# Altium schematic sheet HDMI_OUT.SchDoc
size B
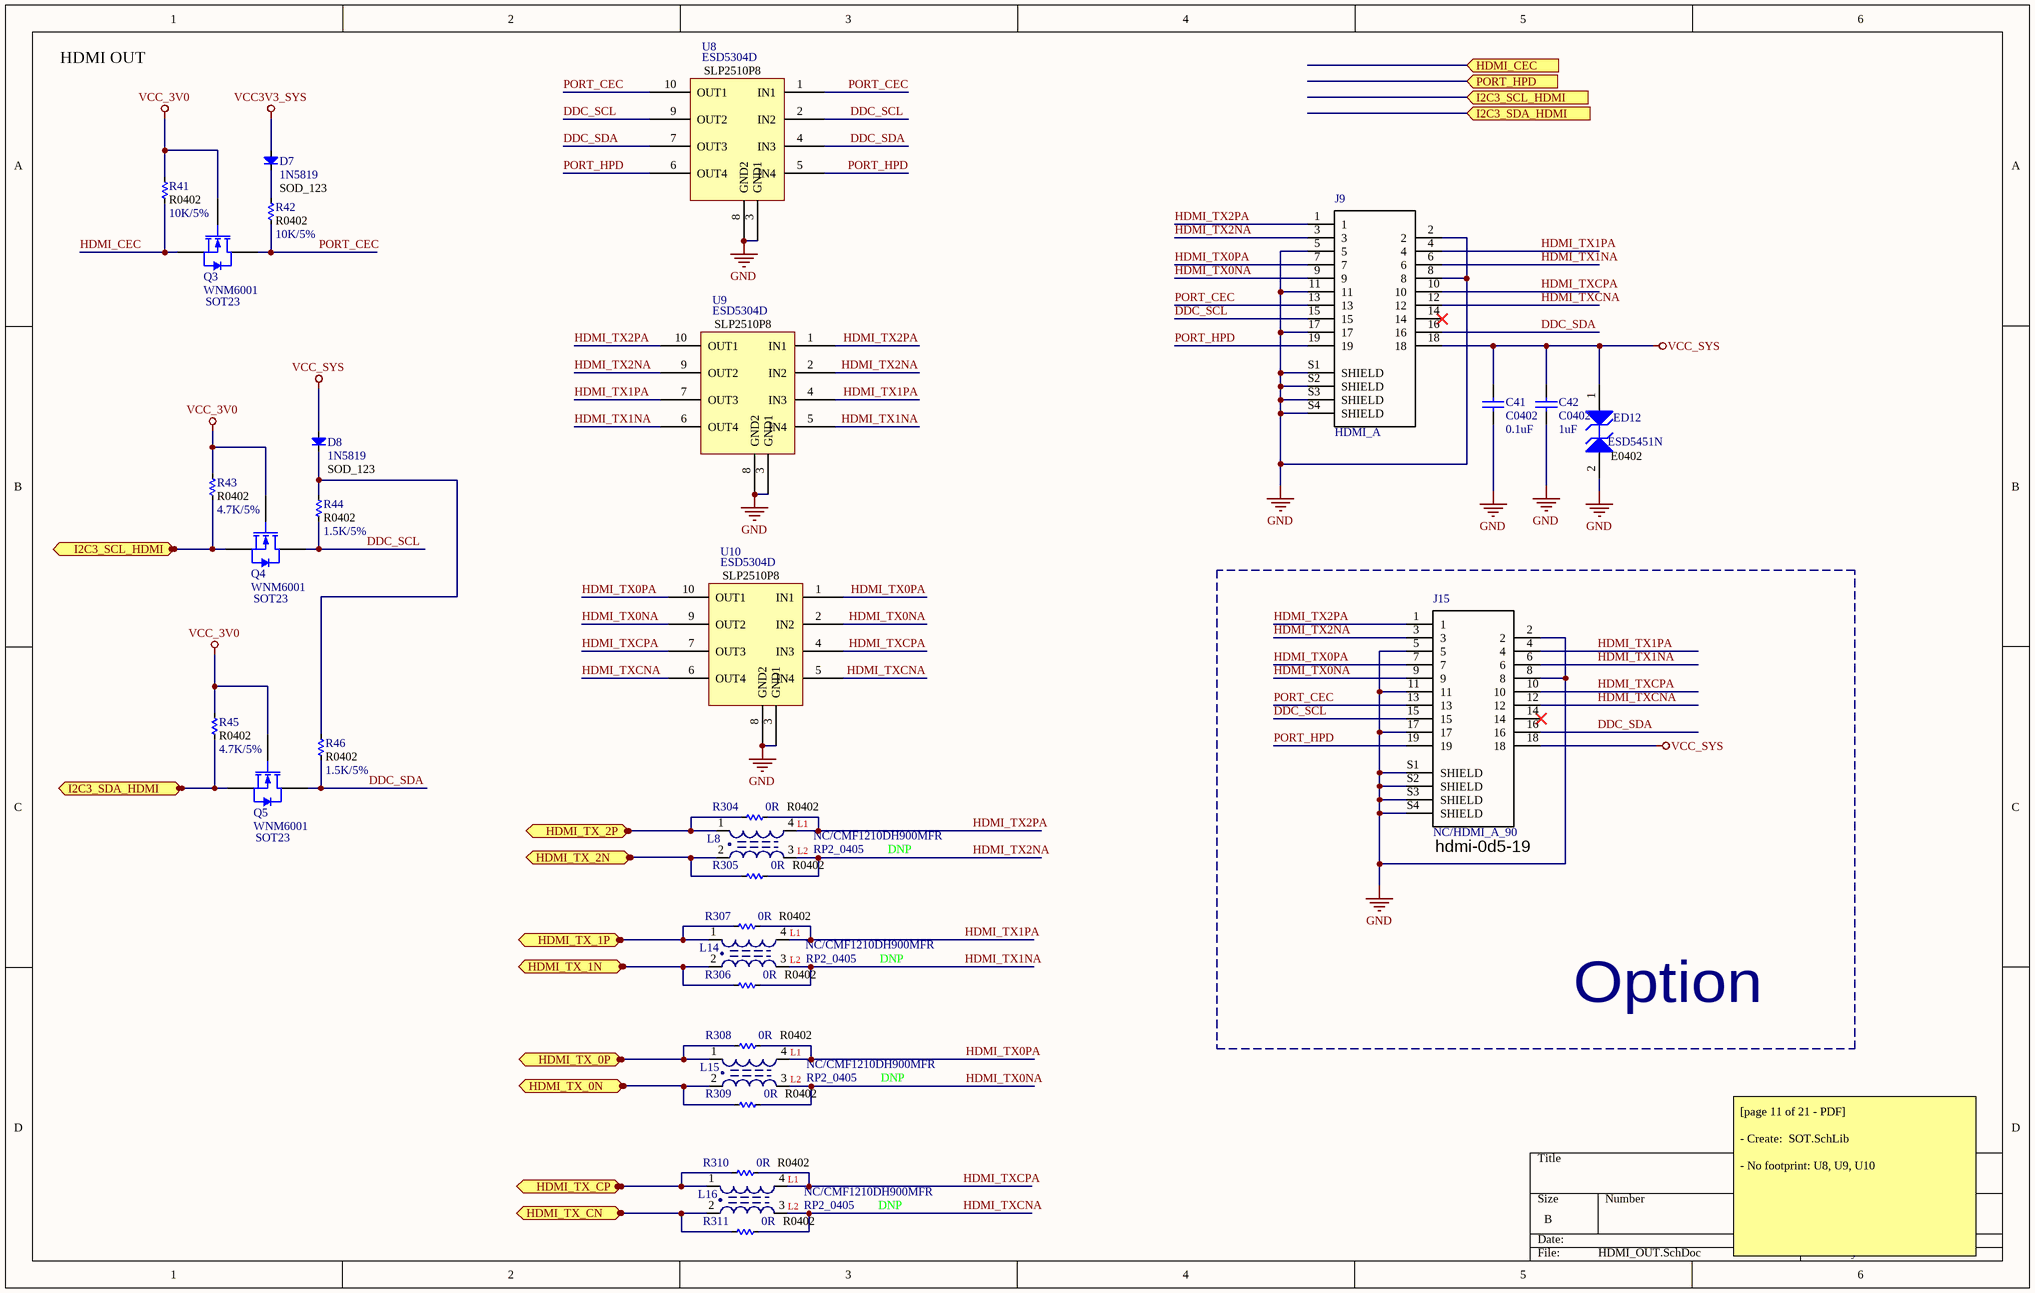
[diagram p0: HDMI_OUT.SchDoc]

## Parts
C41  C0402  value 0.1uF  [C 0402]
C42  C0402  value 1uF  [C 0402]
D7  value 1N5819  typr: SOD_123  [DIO-SMD-123]  (hidden comment: Diode SMD)
D8  value 1N5819  typr: SOD_123  [DIO-SMD-123]  (hidden comment: Diode SMD)
ED12  ESD5451N  [DFN1006-2L]
J9  HDMI_A  [*AMPHENOL_10029449-001RLF_10029449-001RLF(Primary)]
J15  NC/HDMI_A_90  Package: hdmi-0d5-19  [*AMPHENOL_10029449-001RLF_10029449-001RLF(Primary)]
L8  RP2_0405  [L-SMD-D-7.3x7.3]
L14  RP2_0405  [L-SMD-D-7.3x7.3]
L15  RP2_0405  [L-SMD-D-7.3x7.3]
L16  RP2_0405  [L-SMD-D-7.3x7.3]
Q3  WNM6001  [SOT23]
Q4  WNM6001  [SOT23]
Q5  WNM6001  [SOT23]
R41  R0402  value 10K/5%  [R 0402]
R42  R0402  value 10K/5%  [R 0402]
R43  R0402  value 4.7K/5%  [R 0402]
R44  R0402  value 1.5K/5%  [R 0402]
R45  R0402  value 4.7K/5%  [R 0402]
R46  R0402  value 1.5K/5%  [R 0402]
R304  R0402  value 0R  [R 0402]
R305  R0402  value 0R  [R 0402]
R306  R0402  value 0R  [R 0402]
R307  R0402  value 0R  [R 0402]
R308  R0402  value 0R  [R 0402]
R309  R0402  value 0R  [R 0402]
R310  R0402  value 0R  [R 0402]
R311  R0402  value 0R  [R 0402]
U8  ESD5304D  [RCLAMP0524PATCT]
U9  ESD5304D  [RCLAMP0524PATCT]
U10  ESD5304D  [RCLAMP0524PATCT]

## Blocks framed on the sheet
Option: J15

## Ports
HDMI_CEC (in), HDMI_TX_0N (in), HDMI_TX_0P (in), HDMI_TX_1N (in), HDMI_TX_1P (in), HDMI_TX_2N (in), HDMI_TX_2P (in), HDMI_TX_CN (in), HDMI_TX_CP (in), I2C3_SCL_HDMI (in), I2C3_SCL_HDMI (out), I2C3_SDA_HDMI (in), I2C3_SDA_HDMI (out), PORT_HPD (in)

## Nets
GND: C41.2 C42.2 ED12.2(A2) J9.2 J9.5 J9.8 J9.11 J9.17 J9.S1(SHIELD) J9.S2(SHIELD) J9.S3(SHIELD) J9.S4(SHIELD) J15.2 J15.5 J15.8 J15.11 J15.17 J15.S1(SHIELD) J15.S2(SHIELD) J15.S3(SHIELD) J15.S4(SHIELD) U8.3(GND1) U8.8(GND2) U9.3(GND1) U9.8(GND2) U10.3(GND1) U10.8(GND2)
VCC3V3_SYS: D7.1(A)
VCC_3V0: Q3.3(G) Q4.3(G) Q5.3(G) R41.2 R43.2 R45.2
VCC_SYS: C41.1 C42.1 D8.1(A) ED12.1(A1) J9.18 J15.18
DDC_SCL: J9.15 J15.15 Q4.1(D) R44.1 U8.2(IN2) U8.9(OUT2)
DDC_SDA: J9.16 J15.16 Q5.1(D) R46.1 U8.4(IN3) U8.7(OUT3)
HDMI_CEC: Q3.2(S) R41.1
HDMI_TX0NA: J9.9 J15.9 L15.3 R309.1 U10.2(IN2) U10.9(OUT2)
HDMI_TX0PA: J9.7 J15.7 L15.4 R308.1 U10.1(IN1) U10.10(OUT1)
HDMI_TX1NA: J9.6 J15.6 L14.3 R306.1 U9.5(IN4) U9.6(OUT4)
HDMI_TX1PA: J9.4 J15.4 L14.4 R307.1 U9.4(IN3) U9.7(OUT3)
HDMI_TX2NA: J9.3 J15.3 L8.3 R305.1 U9.2(IN2) U9.9(OUT2)
HDMI_TX2PA: J9.1 J15.1 L8.4 R304.1 U9.1(IN1) U9.10(OUT1)
HDMI_TX_0N: L15.2 R309.2 ; port HDMI_TX_0N
HDMI_TX_0P: L15.1 R308.2 ; port HDMI_TX_0P
HDMI_TX_1N: L14.2 R306.2 ; port HDMI_TX_1N
HDMI_TX_1P: L14.1 R307.2 ; port HDMI_TX_1P
HDMI_TX_2N: L8.2 R305.2 ; port HDMI_TX_2N
HDMI_TX_2P: L8.1 R304.2 ; port HDMI_TX_2P
HDMI_TX_CN: L16.2 R311.2 ; port HDMI_TX_CN
HDMI_TX_CP: L16.1 R310.2 ; port HDMI_TX_CP
HDMI_TXCNA: J9.12 J15.12 L16.3 R311.1 U10.5(IN4) U10.6(OUT4)
HDMI_TXCPA: J9.10 J15.10 L16.4 R310.1 U10.4(IN3) U10.7(OUT3)
I2C3_SCL_HDMI: Q4.2(S) R43.1 ; port I2C3_SCL_HDMI
I2C3_SDA_HDMI: Q5.2(S) R45.1 ; port I2C3_SDA_HDMI
PORT_CEC: J9.13 J15.13 Q3.1(D) R42.1 U8.1(IN1) U8.10(OUT1)
PORT_HPD: J9.19 J15.19 U8.5(IN4) U8.6(OUT4)
NetD7_2: D7.2(K) R42.2
NetD8_2: D8.2(K) R44.2 R46.2

Not connected (* = marked no-connect by the designer): J9 14*; J15 14*

## Notes on the sheet
- HDMI OUT
- [page 11 of 21 - PDF]
  - Create:  SOT.SchLib
  - No footprint: U8, U9, U10
- (in symbol 1SMB54CAT3) E0402
- (in symbol L-SMD-2) L1; NC/CMF1210DH900MFR; L2; DNP

## Library data of the parts
C41 C42 = Cap: Capacitor; Published: 8-Jun-2000; LatestRevisionDate: 17-Jul-2002; LatestRevisionNote: Re-released for DXP Platform.; PackageReference: RAD-0.3; Publisher: Altium Limited; PackageDescription: Radial Cap, Thru-Hole; 2 Leads; 0.3 in Pin Spacing
D7 D8 = Diode SMD: Default Diode; Code - JEDEC: DO-214-AB; Published: 8-Jun-2000; Revision: July-2002: Re-released for DXP Platform.; Publisher: Altium Limited
ED12 = 1SMB54CAT3: 600 W Peak Power Zener Transient Voltage Suppressor, Bidirectional, 2-Pin SMB, Tape and Reel; Manufacturer: On Semiconductor; IR Max (uA): 5; PPK Max (W): 600; V(BR) Typ (V): 63.16; DatasheetVersion: Rev. A; PackageVersion: Rev. A, 01/2000; PackageReference: SMB-2-403C-01; PackageDescription: 2-Pin Small Molded Package, J-Bend Lead, Body 4.315 x 3.555 mm; Supplier 1: Digi-Key; Supplier Part Number 1: 1SMB54CAT3-ND; Direction: Bidirectional; Packing: Tape and Reel; Mounting Technology: Surface Mount; PartNumber: 1SMB54CAT3; ComponentLink1Description: Manufacturer URL; ComponentLink1URL: http://www.onsemi.com/; ComponentLink2Description: Datasheet; ComponentLink2URL: http://www.onsemi.com/pub_link/Collateral/1SMB10CAT3-D.PDF; ComponentLink3Description: Package Specification; ComponentLink3URL: http://www.onsemi.com/pub_link/Collateral/1SMB10CAT3-D.PDF
J9 J15 = 10029449-001RLF: Connector, Hdmi Type a, Receptacle, 19 Position, Full Reel; MF: Amphenol ICC; MP: 10029449-001RLF; Availability: Unavailable; SnapEDA_Link: https://www.snapeda.com/parts/10029449-001RLF/Amphenol%20ICC/view-part/?ref=snap; Price: None; Value: *
  J9: Package: None
L8 L14-L16 = L-SMD-2: partNo: 7448709022; Manufacturer: Würth Elektronik eiSos GmbH; Inductance: 2.20 µH; ComponentLink1Description: Manufacturer; ComponentLink1URL: http://www.we-online.de; Created by: Christin Otto; Created Date: August 2013; ComponentLink2Description: Datasheet; ComponentLink2URL: http://katalog.we-online.de/pbs/datasheet/7448709022.pdf
Q3-Q5 = ZXM61N02F: 20V N-Channel Enhancement Mode MOSFET; Published: 17-Dec-2003; DatasheetVersion: May-99; PackageVersion: 1996; PackageReference: SOT23; Publisher: Altium Limited; PackageDescription: SOT-23; 3 Leads; Body 3.1 x 2.5 mm, inc. leads (LxW max), Alternate Lead Configuration; ComponentLink1Description: Manufacturer Link; ComponentLink1URL: http://www.zetex.com/; ComponentLink2Description: Datasheet; ComponentLink2URL: www.zetex.com/3.0/pdf/ZXM61N02F.pdf
R41-R46 R304-R311 = Res-SMD: Resistor; Manufacturer: Generic Components; Class: Passive; Published: 08/06/2000; Publisher: Altium Hobart Technology Centre
U8-U10 = SLP2510P8